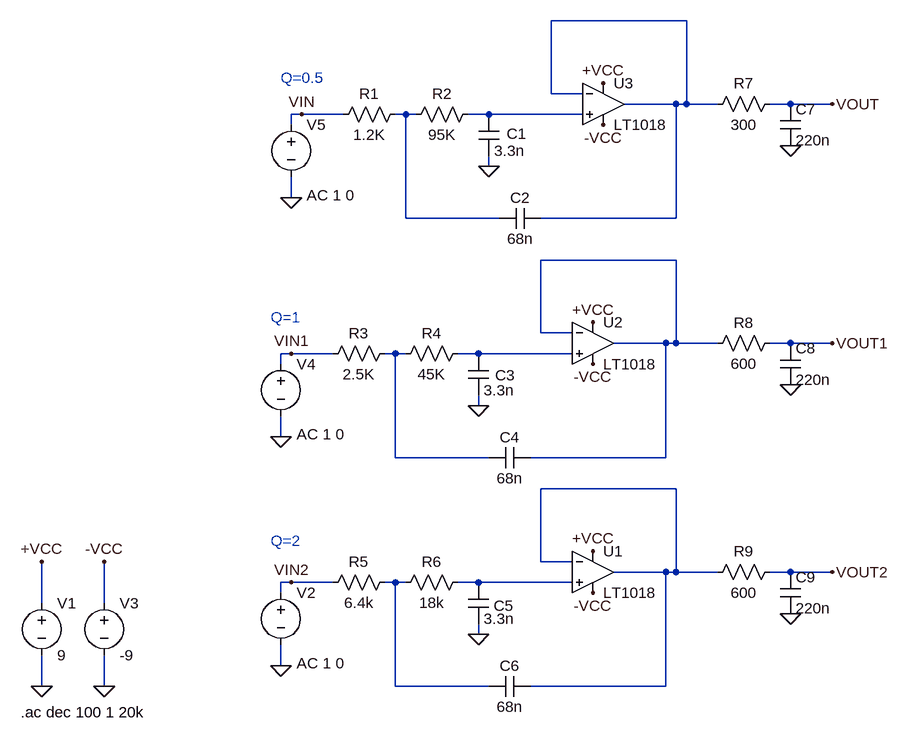
[diagram p0: schematic Filter_final v2.asc]
Filter_final v2.asc, the LTspice schematic file:
Version 4
SHEET 1 1024 1136
WIRE 704 -352 496 -352
WIRE 496 -240 496 -352
WIRE 544 -240 496 -240
WIRE 688 -224 608 -224
WIRE 704 -224 704 -352
WIRE 704 -224 688 -224
WIRE 752 -224 704 -224
WIRE 864 -224 832 -224
WIRE 928 -224 864 -224
WIRE 112 -208 96 -208
WIRE 176 -208 112 -208
WIRE 272 -208 256 -208
WIRE 288 -208 272 -208
WIRE 400 -208 368 -208
WIRE 544 -208 400 -208
WIRE 96 -192 96 -208
WIRE 400 -128 400 -144
WIRE 96 -80 96 -112
WIRE 272 -48 272 -208
WIRE 416 -48 272 -48
WIRE 688 -48 688 -224
WIRE 688 -48 480 -48
WIRE 688 16 480 16
WIRE 480 128 480 16
WIRE 528 128 480 128
WIRE 672 144 592 144
WIRE 688 144 688 16
WIRE 688 144 672 144
WIRE 752 144 688 144
WIRE 864 144 832 144
WIRE 928 144 864 144
WIRE 96 160 80 160
WIRE 160 160 96 160
WIRE 256 160 240 160
WIRE 272 160 256 160
WIRE 384 160 352 160
WIRE 528 160 384 160
WIRE 80 176 80 160
WIRE 384 240 384 224
WIRE 80 288 80 256
WIRE 256 320 256 160
WIRE 400 320 256 320
WIRE 672 320 672 144
WIRE 672 320 464 320
WIRE 688 368 480 368
WIRE 480 480 480 368
WIRE 528 480 480 480
WIRE 672 496 592 496
WIRE 688 496 688 368
WIRE 688 496 672 496
WIRE 752 496 688 496
WIRE 864 496 832 496
WIRE 928 496 864 496
WIRE 96 512 80 512
WIRE 160 512 96 512
WIRE 256 512 240 512
WIRE 272 512 256 512
WIRE 384 512 352 512
WIRE 528 512 384 512
WIRE 80 528 80 512
WIRE -288 544 -288 480
WIRE -192 544 -192 480
WIRE 384 592 384 576
WIRE 80 640 80 608
WIRE -288 672 -288 624
WIRE -192 672 -192 624
WIRE 256 672 256 512
WIRE 400 672 256 672
WIRE 672 672 672 496
WIRE 672 672 464 672
FLAG 80 640 0
FLAG 384 592 0
FLAG -288 672 0
FLAG -288 480 +VCC
FLAG -192 672 0
FLAG -192 480 -VCC
FLAG 560 464 +VCC
FLAG 560 528 -VCC
FLAG 96 512 VIN2
FLAG 928 496 VOUT2
FLAG 80 288 0
FLAG 384 240 0
FLAG 560 112 +VCC
FLAG 560 176 -VCC
FLAG 96 160 VIN1
FLAG 928 144 VOUT1
FLAG 96 -80 0
FLAG 400 -128 0
FLAG 576 -256 +VCC
FLAG 576 -192 -VCC
FLAG 112 -208 VIN
FLAG 928 -224 VOUT
FLAG 864 -160 0
FLAG 864 208 0
FLAG 864 560 0
SYMBOL Comparators\\LT1018 560 496 R0
SYMATTR InstName U1
SYMBOL voltage 80 512 R0
WINDOW 123 24 124 Left 2
WINDOW 39 0 0 Left 0
SYMATTR Value2 AC 1 0
SYMATTR InstName V2
SYMATTR Value ""
SYMBOL cap 368 512 R0
WINDOW 0 39 36 Left 2
SYMATTR InstName C5
SYMATTR Value 3.3n
SYMBOL res 368 496 R90
WINDOW 0 0 56 VBottom 2
WINDOW 3 32 56 VTop 2
SYMATTR InstName R6
SYMATTR Value 18k
SYMBOL res 256 496 R90
WINDOW 0 0 56 VBottom 2
WINDOW 3 32 56 VTop 2
SYMATTR InstName R5
SYMATTR Value 6.4k
SYMBOL cap 464 656 R90
WINDOW 0 0 32 VBottom 2
WINDOW 3 32 32 VTop 2
SYMATTR InstName C6
SYMATTR Value 68n
SYMBOL voltage -288 528 R0
WINDOW 123 0 0 Left 0
WINDOW 39 0 0 Left 0
SYMATTR InstName V1
SYMATTR Value 9
SYMBOL voltage -192 528 R0
WINDOW 123 0 0 Left 0
WINDOW 39 0 0 Left 0
SYMATTR InstName V3
SYMATTR Value -9
SYMBOL Comparators\\LT1018 560 144 R0
SYMATTR InstName U2
SYMBOL voltage 80 160 R0
WINDOW 123 24 124 Left 2
WINDOW 39 0 0 Left 0
SYMATTR Value2 AC 1 0
SYMATTR InstName V4
SYMATTR Value ""
SYMBOL cap 368 160 R0
WINDOW 0 42 33 Left 2
SYMATTR InstName C3
SYMATTR Value 3.3n
SYMBOL res 368 144 R90
WINDOW 0 0 56 VBottom 2
WINDOW 3 32 56 VTop 2
SYMATTR InstName R4
SYMATTR Value 45K
SYMBOL res 256 144 R90
WINDOW 0 0 56 VBottom 2
WINDOW 3 32 56 VTop 2
SYMATTR InstName R3
SYMATTR Value 2.5K
SYMBOL cap 464 304 R90
WINDOW 0 0 32 VBottom 2
WINDOW 3 32 32 VTop 2
SYMATTR InstName C4
SYMATTR Value 68n
SYMBOL Comparators\\LT1018 576 -224 R0
SYMATTR InstName U3
SYMBOL voltage 96 -208 R0
WINDOW 123 24 124 Left 2
WINDOW 39 0 0 Left 0
SYMATTR Value2 AC 1 0
SYMATTR InstName V5
SYMATTR Value ""
SYMBOL cap 384 -208 R0
WINDOW 0 43 30 Left 2
SYMATTR InstName C1
SYMATTR Value 3.3n
SYMBOL res 384 -224 R90
WINDOW 0 0 56 VBottom 2
WINDOW 3 32 56 VTop 2
SYMATTR InstName R2
SYMATTR Value 95K
SYMBOL res 272 -224 R90
WINDOW 0 0 56 VBottom 2
WINDOW 3 32 56 VTop 2
SYMATTR InstName R1
SYMATTR Value 1.2K
SYMBOL cap 480 -64 R90
WINDOW 0 0 32 VBottom 2
WINDOW 3 32 32 VTop 2
SYMATTR InstName C2
SYMATTR Value 68n
SYMBOL res 848 -240 R90
WINDOW 0 0 56 VBottom 2
WINDOW 3 32 56 VTop 2
SYMATTR InstName R7
SYMATTR Value 300
SYMBOL cap 848 -224 R0
SYMATTR InstName C7
SYMATTR Value 220n
SYMBOL res 848 128 R90
WINDOW 0 0 56 VBottom 2
WINDOW 3 32 56 VTop 2
SYMATTR InstName R8
SYMATTR Value 600
SYMBOL cap 848 144 R0
SYMATTR InstName C8
SYMATTR Value 220n
SYMBOL res 848 480 R90
WINDOW 0 0 56 VBottom 2
WINDOW 3 32 56 VTop 2
SYMATTR InstName R9
SYMATTR Value 600
SYMBOL cap 848 496 R0
SYMATTR InstName C9
SYMATTR Value 220n
TEXT -320 712 Left 2 !.ac dec 100 1 20k
TEXT 64 104 Left 2 ;Q=1
TEXT 64 448 Left 2 ;Q=2
TEXT 80 -264 Left 2 ;Q=0.5

The netlist it stands for:
* Filter_final v2.asc
XU1 N009 N007 +VCC -VCC N007 LT1018  ; pins In+ In- V+ V- OUT
V2 VIN2 0 AC 1 0
C5 N009 0 3.3n
R6 N009 N008 18k
R5 N008 VIN2 6.4k
C6 N007 N008 68n
V1 +VCC 0 9
V3 -VCC 0 -9
XU2 N006 N004 +VCC -VCC N004 LT1018  ; pins In+ In- V+ V- OUT
V4 VIN1 0 AC 1 0
C3 N006 0 3.3n
R4 N006 N005 45K
R3 N005 VIN1 2.5K
C4 N004 N005 68n
XU3 N003 N001 +VCC -VCC N001 LT1018  ; pins In+ In- V+ V- OUT
V5 VIN 0 AC 1 0
C1 N003 0 3.3n
R2 N003 N002 95K
R1 N002 VIN 1.2K
C2 N001 N002 68n
R7 VOUT N001 300
C7 VOUT 0 220n
R8 VOUT1 N004 600
C8 VOUT1 0 220n
R9 VOUT2 N007 600
C9 VOUT2 0 220n
.ac dec 100 1 20k
* Q=1
* Q=2
* Q=0.5
.lib LTC1.lib
.backanno
.end